# EAGLE design SMT Logic Board (8803) (EAGLE 9.6.2)
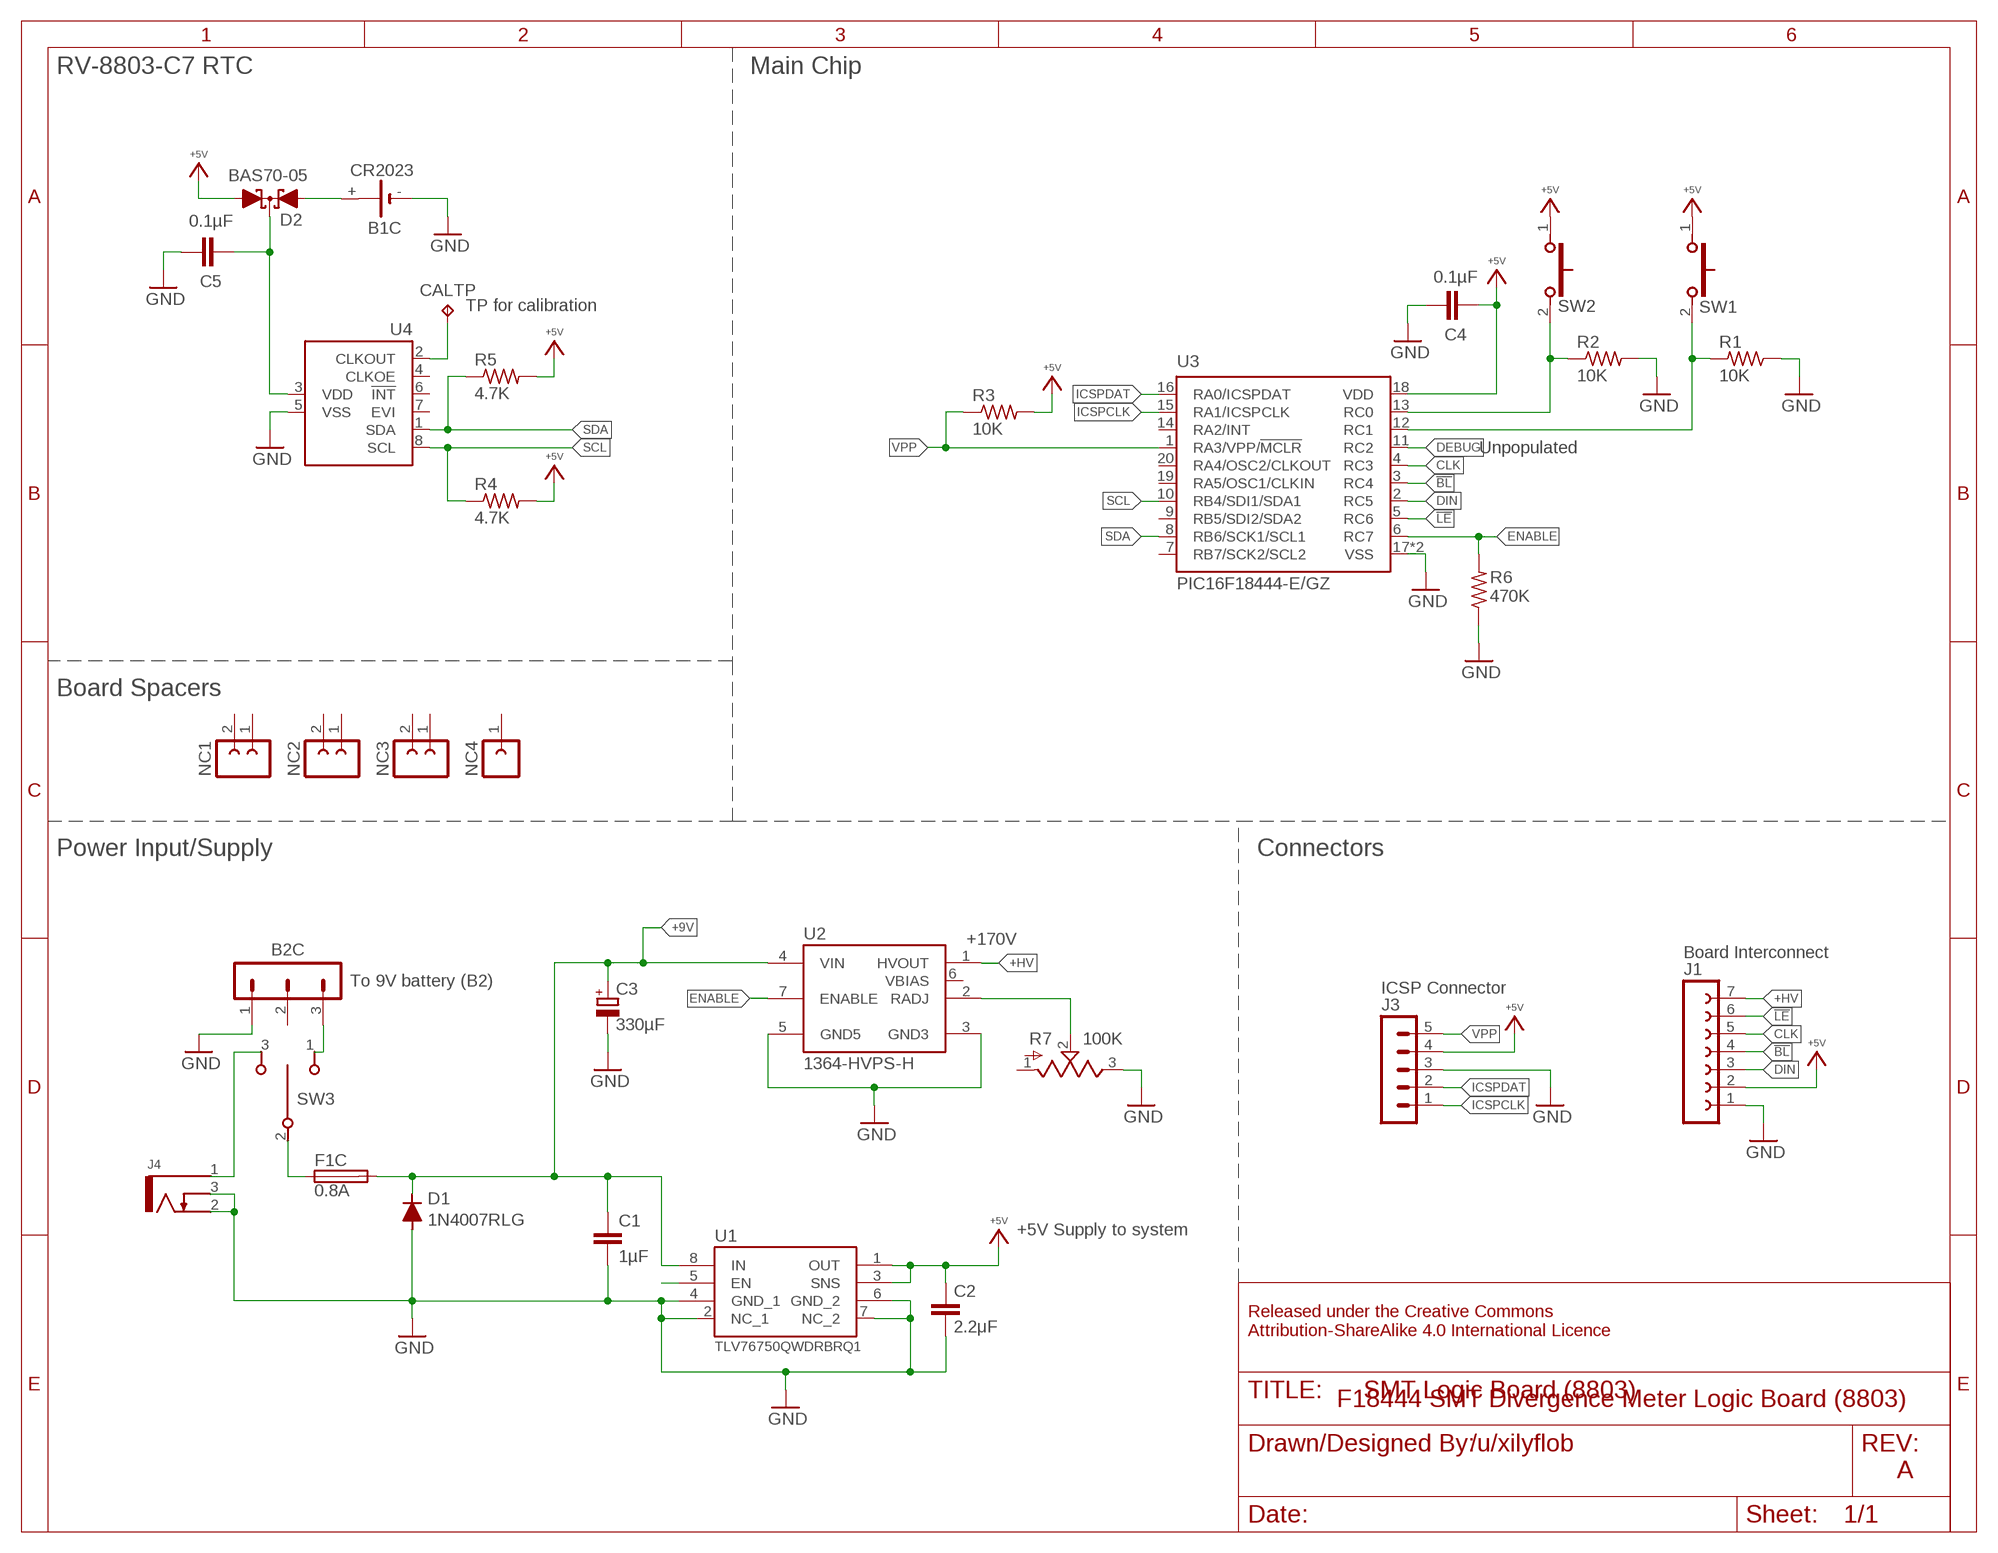
[diagram p0: schematic, sheet 1]

## Parts
B1C  CR2023  BATTERY  [103]
B2C  53253_3P  [532530370]
C1  1µF  C-EU  [C0805]
C2  2.2μF  C-EU  [C0805]
C3  330µF  CPOL-EU6.3MM_SMD_CHIP  [6.3MM_SMD_CHIP]
C4  0.1µF  C-EU  [C0805]
C5  0.1µF  C-EU  [C0805]
CALTP  TPTP18R  [TP18R]
D1  1N4007RLG  RECTIFIERSMA-403D  [SMA-403D]
D2  BAS70-05  [SOT323]
F1C  0.8A  FUSE  [5X20MM]
J1  FE07FE07  [FE07]
J3  MA05  [MA05]
J4  KLDX-0202-B  [KDLX-0202-X]
NC1  FE02  [FE02]
NC2  FE02  [FE02]
NC3  FE02  [FE02]
NC4  FE01  [FE01]
R1  10K  R-US  [R0805]
R2  10K  R-US  [R0805]
R3  10K  R-US  [R0805]
R4  4.7K  R-US  [R0805]
R5  4.7K  R-US  [R0805]
R6  470K  R-US  [R0805]
R7  100K  R-US_TRIM3224W  [3224W]
SW1  FSMRA4JH04  SWITCH_PUSH_SPST_(ON)  [FSMRA4JH]
SW2  FSMRA4JH04  SWITCH_PUSH_SPST_(ON)  [FSMRA4JH]
SW3  5MS1S102AM6QES  SWITCH_SLIDE_SPDT_ON  [SLIDE_SPDT_MINI]
U1  TLV76750QWDRBRQ1  TLV766-Q1  [SON_8_FIXED]
U2  1364-HVPS-H  [1364-HVPS-H]
U3  PIC16F18444-E/GZ  PIC16F184  [UQFN-20]
U4  RV-8803-C7  [C7]

## Nets
!BL!: J1.4 U3.3(RC4)
!LE!: J1.6 U3.5(RC6)
+5V: C2.1 C4.1 D2.2(A2) J1.2 J3.4 R3.2 R4.2 R5.2 SW1.1 SW2.1 U1.1(OUT) U1.3(SNS) U3.18(VDD)
+9V: C1.1 C3.+ D1.C F1C.2A F1C.2B U1.8(IN) U2.4(VIN)
+9V_1: F1C.1A F1C.1B SW3.2(COM)
+9V_2: J4.1 SW3.3(POS_2)
+9V_3: B2C.3 SW3.1(POS_1)
+HV: J1.7 U2.1(HVOUT)
CLK: J1.5 U3.4(RC3)
CLKTEST: CALTP.TP U4.2(CLKOUT)
DEBUG: U3.11(RC2)
DIN: J1.3 U3.2(RC5)
EN: U1.5(EN)
ENABLE: R6.2 U2.7(ENABLE) U3.6(RC7)
GND: B1C.- B2C.1 C1.2 C2.2 C3.- C4.2 C5.2 D1.A J1.1 J3.3 J4.2 J4.3 R1.1 R2.2 R6.1 R7.3 U1.2(NC_1) U1.4(GND_1) U1.6(GND_2) U1.7(NC_2) U1.TP U1.TV_1(TP) U1.TV_2(TP) U1.TV_3(TP) U1.TV_4(TP) U1.TV_5(TP) U1.TV_6(TP) U1.TV_7(TP) U1.TV_8(TP) U1.TV_9(TP) U2.3(GND3) U2.5(GND5) U3.17(VSS) U3.21(VSS) U4.5(VSS)
ICSPCLK: J3.1 U3.15(RA1/ICSPCLK)
ICSPDAT: J3.2 U3.16(RA0/ICSPDAT)
RADJ: R7.2 U2.2(RADJ)
RTCPWR: C5.1 D2.3(C) U4.3(VDD)
SCL: R4.1 U3.10(RB4/SDI1/SDA1) U4.8(SCL)
SDA: R5.1 U3.8(RB6/SCK1/SCL1) U4.1(SDA)
SW1: R1.2 SW1.2 U3.12(RC1)
SW2: R2.1 SW2.2 U3.13(RC0)
VBAK: B1C.+ D2.1(A1)
VPP: J3.5 R3.1 U3.1(RA3/VPP/!MCLR!)
Unconnected: B2C.2 NC1.1 NC1.2 NC2.1 NC2.2 NC3.1 NC3.2 NC4.1 R7.1 U2.6(VBIAS) U3.7(RB7/SCK2/SCL2) U3.9(RB5/SDI2/SDA2) U3.14(RA2/INT) U3.19(RA5/OSC1/CLKIN) U3.20(RA4/OSC2/CLKOUT) U4.4(CLKOE) U4.6(!INT) U4.7(EVI)

## Notes on the sheet
- RV-8803-C7 RTC | Main Chip
- TP for calibration
- Unpopulated
- Board Spacers
- Power Input/Supply | Connectors
- +170V
- Board Interconnect
- To 9V battery (B2)
- ICSP Connector
- +5V Supply to system
- Released under the Creative Commons
  Attribution-ShareAlike 4.0 International Licence
- F18444 SMT Divergence Meter Logic Board (8803)
- /u/xilyflob
- A

## Library data of the parts
B1C = My Imported Components:BATTERY: LI BATTERY Varta
B2C = My Imported Components:53253_3P: Molex 53253-0370
C1 C2 C4 C5 = My Imported Components:C-EU
C3 = My Imported Components:CPOL-EU
CALTP = testpad:TP: Test pad
D1 = My Imported Components:RECTIFIER
D2 = My Imported Components:BAS70-05: Silicon Schottky Diodes General-purpose diode for high-speed switching
F1C = My Imported Components:FUSE
J1 = My Imported Components:FE07: FEMALE HEADER
J3 = My Imported Components:MA05: PIN HEADER
J4 = My Imported Components:KLDX-0202-B: https://www.mouser.com/datasheet/2/222/KLDX_0202-334781.pdf
NC1-NC3 = My Imported Components:FE02: FEMALE HEADER
NC4 = My Imported Components:FE01: FEMALE HEADER
R1-R6 = My Imported Components:R-US: RESISTOR, American symbol
R7 = My Imported Components:R-US_TRIM: Res Cermet Trimmer 1M Ohm 10% 1/4W 12(Elec)Turn 1.8mm (6.4 X 4 X 7.7mm) Pin Thru-Hole Bulk Check prices <https://pricing.snapeda.com/parts/PV37W104C01B00/Bourns/view-part?ref=eda>
SW1 SW2 = My Imported Components:SWITCH_PUSH_SPST_(ON)
SW3 = My Imported Components:SWITCH_SLIDE_SPDT_ON
U1 = My Imported Components:TLV766-Q1
U2 = My Imported Components:1364-HVPS-H: https://www.shop-tes.com/content/Datasheets/8002K.pdf
U3 = My Imported Components:PIC16F184*
U4 = My Imported Components:RV-8803-C7

## Board
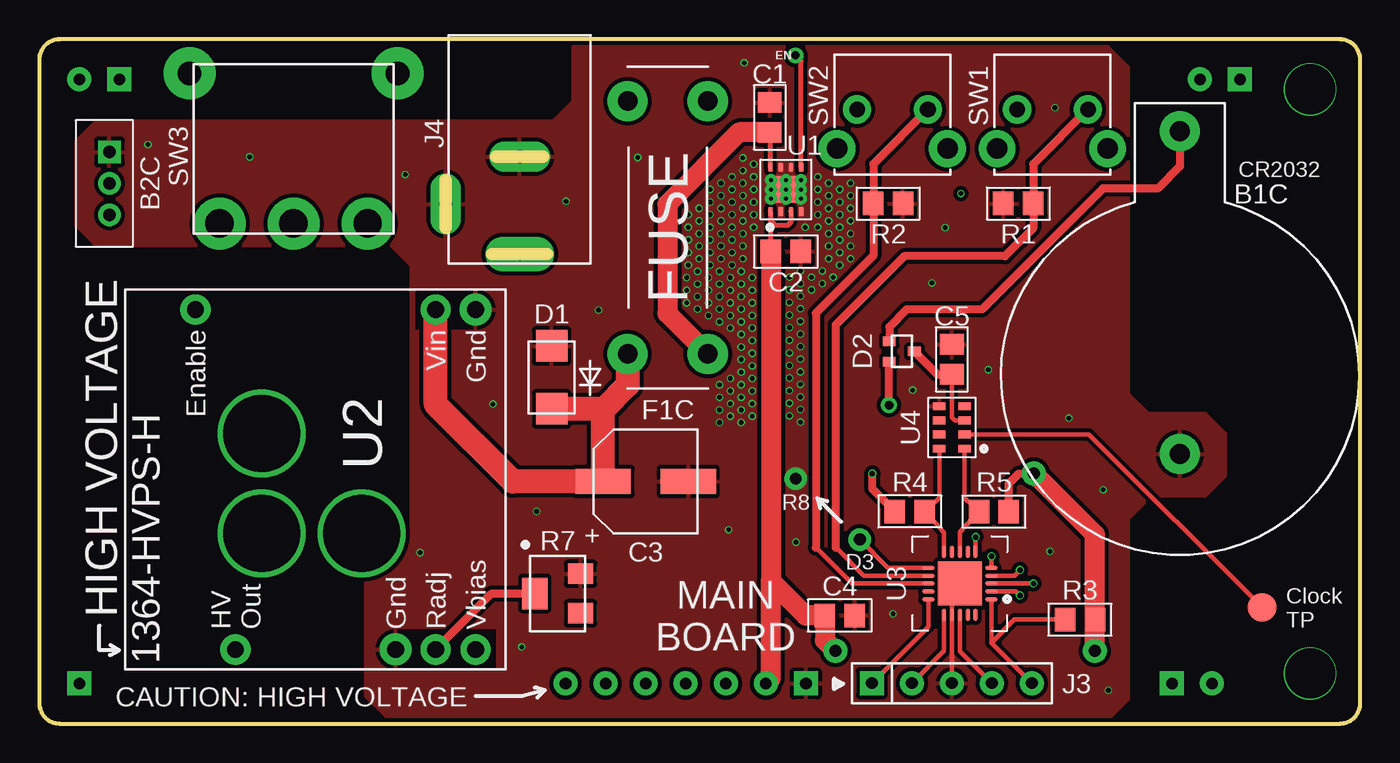
[diagram p1: board, top side]
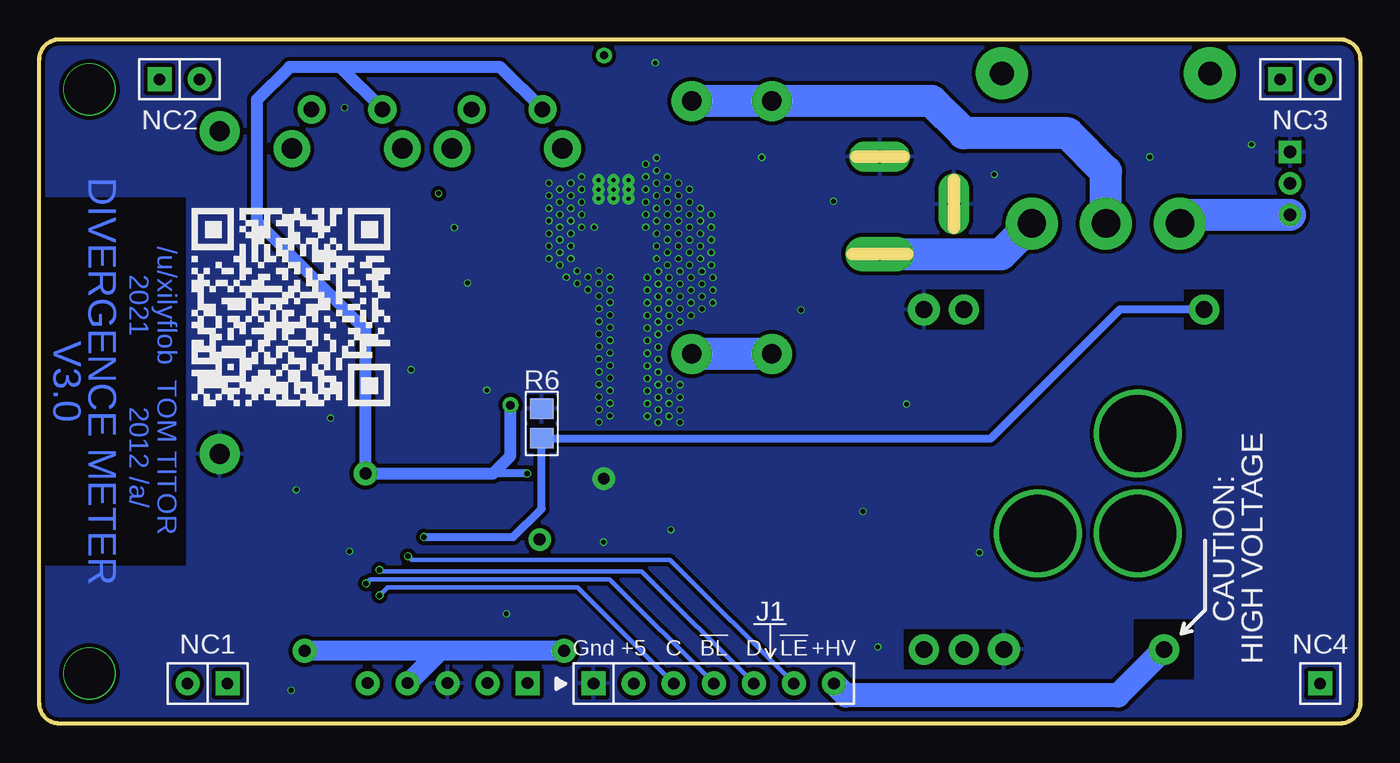
[diagram p2: board, bottom side, seen from below]

Size 83.82 x 43.43 mm. Coordinates in mm from the lower left corner, seen from the top.
Outline: 1.27,0 82.55,0 arc90 83.82,1.27 83.82,42.16 arc90 82.55,43.43 1.27,43.43 arc90 0,42.16 0,1.27 arc90 1.27,0
Copper layers (1*16): Top 0.035mm / dielectric 1.6mm / Bottom 0.035mm
Design rules "jlcpcb-2layers": minimum track width 5mil, minimum drill 0.3mm, track to track 5mil, track to pad 5mil, pad to pad 5mil, via to via 5mil, smd to smd 5mil, copper to edge 0.2mm, drill to drill 6mil, minimum pad ring 10mil, minimum via ring 3mil, stop-mask expansion 4mil, vias tented up to drill 0mil, thermal gap 10mil

### Footprints (pad centres in the part's own frame; a part is rotated, then mirrored left to right if it is on the bottom)
103 = drill 1.27 pad 2.54: + 0,0; - 0,-20.498
532530370 = drill 0.8 pad 1.422 square: 1 -2,0 | drill 0.8 pad 1.422: 2 0,0; 3 2,0
C0805 = smd 1.3 x 1.5: 1 -0.95,0; 2 0.95,0
6.3MM_SMD_CHIP = smd 3.5 x 1.6: + 2.7,0; - -2.7,0
TP18R = smd 1.8 x 1.8: TP 0,0
SMA-403D = smd 2 x 2: A 2,0; C -2,0
SOT323 = smd 0.6 x 0.8: 1 -0.65,-0.8; 2 0.65,-0.8; 3 0,0.8
5X20MM = drill 1.245 pad 2.54: 1A -8.026,2.54; 1B -8.026,-2.54; 2A 8.026,2.54; 2B 8.026,-2.54
FE07 = drill 0.75 pad 1.524 square: 1 -7.62,0 | drill 0.75 pad 1.524: 2 -5.08,0; 3 -2.54,0; 4 0,0; 5 2.54,0; 6 5.08,0; 7 7.62,0
MA05 = drill 0.75 pad 1.524 square: 1 -6.35,0 | drill 0.75 pad 1.524: 2 -3.81,0; 3 -1.27,0; 4 1.27,0; 5 3.81,0
KDLX-0202-X = drill 0.8 pad 2.184 long: 1 13.9,0 | drill 0.8 pad 1.93 long: 2 7.7,0; 3 10.7,-4.7
FE02 = drill 0.75 pad 1.524 square: 1 -1.27,0 | drill 0.75 pad 1.524: 2 1.27,0
FE01 = drill 0.75 pad 1.524 square: 1 0,0
R0805 = smd 1.3 x 1.5: 1 -0.95,0; 2 0.95,0
3224W = smd 1.6 x 1.3: 1 1.45,-1.25; 3 1.45,1.25 | smd 1.6 x 2: 2 -1.45,0
FSMRA4JH = drill 0.991 pad 1.753: 1 4.496,0; 2 0,0 | drill 1.295 pad 2.057: 3 -1.245,2.489; 4 5.766,2.489
SLIDE_SPDT_MINI = drill 1.8 pad 3.302: 1 -4.699,0; 2 0,0; 3 4.699,0 | drill 1.5 pad 3.302: P$4 -6.604,9.525; P$5 6.604,9.525
SON_8_FIXED = smd 0.6 x 0.31: 1 -1.4,0.975; 2 -1.4,0.325; 3 -1.4,-0.325; 4 -1.4,-0.975; 5 1.4,-0.975; 6 1.4,-0.325; 7 1.4,0.325; 8 1.4,0.975 | smd 1.65 x 2.4: TP 0,0 | drill 0.254 pad 0.305: TV_1 0,0.95; TV_2 0.575,0; TV_3 0,-0.95; TV_4 -0.575,0; TV_5 -0.575,0.95; TV_6 0.575,0.95; TV_7 0,0; TV_8 -0.575,-0.95; TV_9 0.575,-0.95
1364-HVPS-H = drill 1.067 pad 1.778: 1 1.27,17.145; 2 1.27,4.445; 4 22.86,4.445; 6 1.27,1.905; 7 22.86,19.685 | drill 1.067 pad 2.032: 3 1.27,6.985; 5 22.86,1.905
UQFN-20 = smd 0.8 x 0.3: 1 -2,1; 2 -2,0.5; 3 -2,0; 4 -2,-0.5; 5 -2,-1; 11 2,-1; 12 2,-0.5; 13 2,0; 14 2,0.5; 15 2,1 | smd 0.3 x 0.8: 6 -1,-2; 7 -0.5,-2; 8 0,-2; 9 0.5,-2; 10 1,-2; 16 1,2; 17 0.5,2; 18 0,2; 19 -0.5,2; 20 -1,2 | smd 2.8 x 2.8: 21 0,0
C7 = smd 0.5 x 0.8: 1 -1.35,-0.8; 2 -0.45,-0.8; 3 0.45,-0.8; 4 1.35,-0.8; 5 1.35,0.8; 6 0.45,0.8; 7 -0.45,0.8; 8 -1.35,0.8

### Placement (x,y rotation side)
B1C  72.39,37.62 0 top
B2C  4.45,34.29 270 top
C1  46.35,38.48 90 top
C2  47.37,29.97 0 top
C3  38.48,15.37 180 top
C4  50.8,6.86 0 top
C5  57.91,23.11 90 top
CALTP  77.6,7.37 0 top
D1  32.51,21.97 90 top
D2  54.74,23.62 270 top
F1C  39.88,31.5 270 top
J1  41.02,2.54 0 bottom
J3  59.18,2.57 0 top
J4  30.48,43.69 270 top
NC1  73.15,2.54 180 bottom
NC2  74.93,40.89 0 bottom
NC3  3.81,40.89 0 bottom
NC4  2.54,2.54 0 bottom
R1  62.13,33.02 0 top
R2  53.87,33.02 0 top
R3  66.04,6.6 0 top
R4  55.24,13.46 180 top
R5  60.58,13.46 0 top
R6  51.94,19.05 270 bottom
R7  32.89,8.26 0 top
SW1  66.55,38.99 180 top
SW2  56.39,38.99 180 top
SW3  16.13,31.75 0 top
U1  47.37,33.91 90 top
U2  29.59,3.43 90 top
U3  58.42,8.89 180 top
U4  57.91,18.8 90 top

### Tracks (layer width: path | path; a pad name or v marks a point on that pad's centre or on a via)
!BL!  (via drill 0.35)
  Top 0.3: U3.3 v63.09,8.89
  Bottom 0.3: v63.09,8.89 62.84,9.14 47.62,9.14 J1.4
!LE!  (via drill 0.35)
  Top 0.3: v60.43,10.62 v60.42,10.61 U3.5
  Bottom 0.3: v60.43,10.62 60.2,10.39 43.79,10.39 J1.6
+5V  (via drill 0.35, 0.55 pad 1.02, 0.75 pad 1.52)
  Top 0.3: J3.4 58.42,4.6 U3.18
  Top 0.31: U1.1 46.4,31.93 | 46.4,31.93 46.4,30 C2.1 | U1.3 47.7,31.85 47.47,31.62 46.7,31.62 46.4,31.93
  Top 0.508: R4.2 52.86,14.9 v52.86,15.88 | R5.2 61.53,15.25 62.15,15.88 v63.12,15.88 | v53.92,20.22 53.92,22.96 D2.2
  Top 1.27: v66.98,4.62 66.99,4.63 R3.2 66.99,12 v63.12,15.88 | v50.52,4.62 49.85,5.29 C4.1 48.63,6.86 46.42,9.07 | C2.1 46.42,9.07 | J1.2 46.42,2.86 46.42,9.07
  Bottom 0.508: v52.86,15.88 55.04,15.88
  Bottom 0.762: SW2.1 54.59,41.68 64.75,41.68 | 64.75,41.68 67.94,41.68 70,39.62 70,31.88 63.12,24.99 v63.12,15.88 55.04,15.88 53.92,16.99 v53.92,20.22 | SW1.1 64.75,41.68
  Bottom 1.27: v50.52,4.62 58.4,4.62 | 58.4,4.62 v66.98,4.62 | J3.4 58.4,4.62
+9V
  Top 0.31: U1.8 46.4,37.49 C1.1
  Top 1.27: F1C.2A 39.85,26.04 39.85,32.97 44.41,37.53 C1.1
  Top 1.524: U2.4 25.15,20.27 30.05,15.37 C3.+ 35.78,19.93 35.82,19.97 | F1C.2B 37.34,21.49 35.82,19.97 | 35.82,19.97 D1.C
  Bottom 2.032: F1C.2B F1C.2A
+9V_1
  Bottom 2.032: SW3.2 16.13,35.05 18.54,37.47 25.15,37.47 27.2,39.52 F1C.1B F1C.1A
+9V_2
  Bottom 2.032: J4.1 22.79,29.79 SW3.3
+9V_3
  Bottom 2.032: SW3.1 10.89,32.29 B2C.3
+HV
  Bottom 1.524: J1.7 32.64,1.78 15.37,1.78 U2.1
CLK  (via drill 0.35)
  Top 0.3: v62.23,9.75 61.87,9.39 U3.4
  Bottom 0.3: v62.23,9.75 62.13,9.65 45.59,9.65 J1.5
CLKTEST
  Top 0.3: U4.2 66.62,18.35 CALTP.TP
DEBUG  (via drill 0.75 pad 1.42)
  Top 0.3: U3.11 53.86,9.89 v52.07,11.68
DIN  (via drill 0.35)
  Top 0.3: v62.23,8.13 61.97,8.39 U3.2
  Bottom 0.3: v62.23,8.13 61.72,8.64 49.66,8.64 J1.3
EN  (via drill 0.5 pad 1)
  Top 0.31: U1.5 48.35,42.06 v47.99,42.42
ENABLE  (via drill 0.35)
  Top 0.3: U3.6 v59.42,11.84
  Bottom 0.508: v59.42,11.84 53.75,11.84 51.94,13.64 R6.2 23.43,18.1 15.24,26.29 U2.7
GND  (via drill 0.3, 0.75 pad 1.42)
  Top 0.3: J3.3 U3.17 57.92,8.39 U3.21
  other vias: 48.01,15.54 44.65,35.11 45.34,34.71 44.65,34.31 45.34,33.91 45.34,33.11 44.65,33.51 44.65,32.71 45.34,32.31 44.65,31.91 45.34,31.51 44.65,31.11 44.65,30.31 44.65,29.51 44.54,28.71 44.54,27.91 45.24,28.31 45.24,27.51 45.24,26.71 45.24,25.91 45.24,25.11 45.24,24.31 44.54,23.91 44.54,24.71 44.54,25.51 44.54,26.31 44.54,27.11 48.6,31.51 49.4,34.71 50.1,34.31 49.4,33.91 49.4,33.11 49.4,32.31 49.4,31.51 50.1,31.11 50.79,31.51 50.79,30.71 50.1,30.31 50.79,29.91 51.48,29.51 50.79,29.11 51.48,30.31 47.61,28.33 48.3,27.93 47.61,27.53 48.3,27.13 48.3,28.73 50.1,29.51 13.34,35.97 28.78,20.28 43.74,12.3 35.49,26.25 48.01,11.51 30.61,4.86 24.16,10.85 6.89,36.76 23.22,34.86 33.43,33.15 37.98,35.95 44.73,41.94 57.48,31.48 56.65,27.97 55.43,21.17 60.23,22.46 65.33,19.39 64.44,39.1 67.52,14.84 67.85,2.12 64.14,10.93 44.65,35.91 45.34,35.51 47.61,26.73 48.3,26.33 47.61,25.93 48.3,25.53 47.61,25.13 48.3,24.73 47.61,24.33 48.3,23.93 47.61,23.53 48.3,23.13 47.61,22.73 48.3,22.33 49,28.33 49.69,27.93 49,27.53 49.69,28.73 50.38,28.33 43.26,31.11 43.95,30.71 43.26,30.31 43.95,29.91 43.26,29.51 43.95,29.11 43.95,34.71 43.26,34.31 43.95,33.91 43.95,33.11 43.26,33.51 43.26,32.71 43.95,32.31 43.26,31.91 43.95,31.51 42.57,33.91 42.57,33.11 41.87,32.71 42.57,32.31 41.87,31.91 42.57,31.51 41.18,32.31 41.18,31.51 41.87,31.11 42.57,30.71 41.87,30.31 42.57,29.91 41.87,29.51 42.57,29.11 41.18,30.71 41.18,29.91 41.18,29.11 43.16,28.71 43.16,27.91 43.85,28.31 43.85,27.51 43.85,26.71 43.85,25.91 43.85,25.11 43.16,25.51 43.16,26.31 43.16,27.11 41.77,28.71 41.77,27.91 42.47,28.31 42.47,27.51 42.47,26.71 42.47,25.91 41.77,26.31 41.77,27.11 41.08,28.31 41.08,27.51 41.08,26.71 54.18,6.97 31.55,13.47 47.61,21.93 48.3,21.53 47.61,21.13 48.3,20.73 47.61,20.33 48.3,19.93 47.61,19.53 48.3,19.13 45.24,23.51 44.54,23.11 45.24,22.71 44.54,22.31 45.24,21.91 44.54,21.51 45.24,21.11 44.54,20.71 45.24,20.31 44.54,19.91 45.24,19.51 44.54,19.11 43.85,21.91 43.16,21.51 43.85,21.11 43.16,20.71 43.85,20.31 43.16,19.91 43.85,19.51 43.16,19.11 50.1,33.51 50.79,33.91 50.1,32.71 50.79,33.11 50.1,31.91 50.79,32.31 51.48,31.11 51.48,31.91 51.48,32.71 51.48,33.51 51.48,34.31
  cutout Bottom: 22.86,3.43 22.86,5.97 28.96,5.97 28.96,3.43
  cutout Bottom: 23.88,25.02 23.88,27.56 27.43,27.56 27.43,25.02
  cutout Bottom: 8.64,25.02 8.64,27.56 11.18,27.56 11.18,25.02
  cutout Top: 10.54,2.79 10.54,6.6 14.35,6.6 14.35,2.79
  cutout Top: 56.44,19.86 58.22,19.86 58.22,20.68 59.39,20.68 59.39,16.92 56.44,16.92
  pour Top (isolate 0.254): 69.09,13 69.09,1.55 68,0.46 22.02,0.46 20.75,1.73 20.75,12.06 23.62,12.06 23.62,29.08 22.35,30.35 3.63,30.35 2.36,31.62 2.36,36.96 3.63,38.23 32.64,38.23 33.91,39.5 33.91,42.98 67.79,42.98 69.09,41.68 69.09,20.93 70.33,19.68 73.96,19.68 75.23,18.41 75.23,15.72 73.96,14.45 70.54,14.45
  cutout Bottom: 83.64,10.03 74.55,10.03 74.55,33.4 83.64,33.4
  pour Bottom (isolate 0.254): 82.55,0.46 1.27,0.46 arc-90 0.46,1.27 0.46,42.16 arc-90 1.27,42.98 82.55,42.98 arc-90 83.36,42.16 83.36,1.27 arc-90
  cutout Bottom: 10.54,2.79 10.54,6.6 14.35,6.6 14.35,2.79
GND1  (via drill 0.3)
  other vias: 58.49,33.65
GND2
  cutout Top: 23.88,25.02 23.88,27.56 27.43,27.56 27.43,25.02
GND3
  cutout Top: 8.64,25.02 8.64,27.56 11.18,27.56 11.18,25.02
GND4
  cutout Top: 22.86,3.43 22.86,5.97 28.96,5.97 28.96,3.43
ICSPCLK
  Top 0.3: J3.1 56.42,6.15 U3.15
ICSPDAT
  Top 0.3: J3.2 57.42,4.61 U3.16
N$1  (via drill 3.17)
  other vias: 80.64,3.17
N$12  (via drill 3.17)
  other vias: 80.64,40.26
N$28  (via drill 4.88 pad 5.59)
  other vias: 14.1,12.06
N$29  (via drill 4.88 pad 5.59)
  other vias: 14.1,18.41
N$30  (via drill 4.88 pad 5.59)
  other vias: 20.45,12.06
RADJ
  Top 0.508: U2.2 28.7,8.26 R7.2
RTCPWR
  Top 0.3: U4.3 58.1,19.25 57.91,19.43 C5.1
  Top 0.508: D2.3 56.99,22.16 C5.1
SCL
  Top 0.3: U4.8 57.12,14.31 R4.1 57.42,12.13 U3.10
SDA
  Top 0.3: U4.1 58.7,17.44 58.7,14.31 R5.1 58.42,12.15 U3.8
SW1
  Top 0.3: U3.12 52.33,9.39 50.55,11.18
  Top 0.508: SW1.2 63.08,35.52 R1.2 63.08,31.45 61.29,29.67 54.89,29.67 50.55,25.32 50.55,11.18
SW2
  Top 0.3: 49.28,11.18 51.56,8.89 U3.13
  Top 0.508: SW2.2 52.92,35.52 R2.1 52.92,29.7 49.28,26.06 49.28,11.18
VBAK
  Top 0.508: B1C.+ 72.39,35.38 70.97,33.96 67.49,33.96 59.82,26.29 55.04,26.29 53.94,25.18 D2.1
VPP
  Top 0.3: 60.42,5.14 U3.1 | R3.1 61.89,6.6 60.42,5.14 | J3.5 60.42,5.14

### Text on the board
Bottom: /u/xilyflob / 2021 | DIVERGENCE METER / V3.0 | TOM TITOR / 2012 /a/
tPlace: EN | CR2032 | R8 | D3 | HIGH VOLTAGE | MAIN / BOARD | CAUTION: HIGH VOLTAGE
bPlace: CAUTION: / HIGH VOLTAGE | +HV | !LE! | D | !BL! | C | +5 | Gnd
tNames: Clock / TP
bStop: /u/xilyflob / 2021 | DIVERGENCE METER / V3.0 | TOM TITOR / 2012 /a/